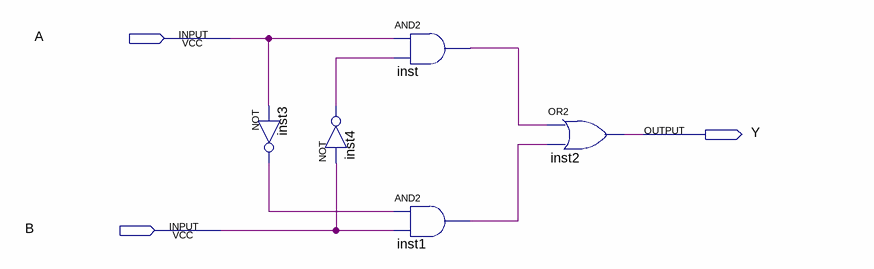
[diagram p0: schematic sheet]
// Quartus schematic Lab1b.bdf as structural Verilog: 5 symbols, 3 pins
module Lab1b (
  input  A,
  input  B,
  output Y
);

  wire inst1_out, inst3_out, inst4_out, inst_out;

  not inst4 (inst4_out, B);
  not inst3 (inst3_out, A);
  and inst (inst_out, A, inst4_out);
  and inst1 (inst1_out, inst3_out, B);
  or inst2 (Y, inst_out, inst1_out);
endmodule
